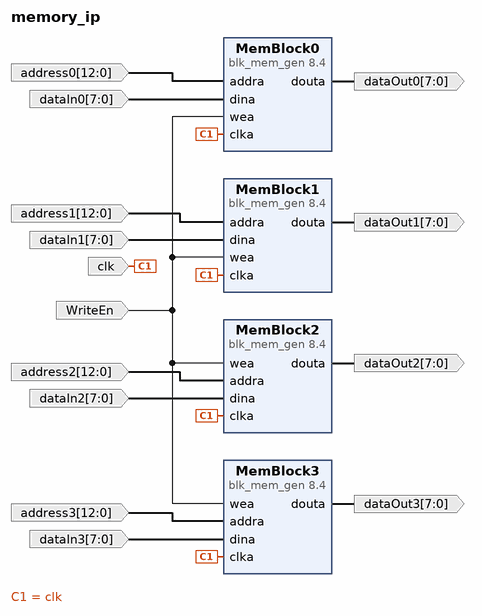
[diagram p0: block diagram of the top level]
# Vivado block design memory_ip, xc7z010clg400-1, Vivado 2023.2
create_bd_design memory_ip

create_bd_port -dir O -from 7 -to 0 dataOut0
create_bd_port -dir O -from 7 -to 0 dataOut1
create_bd_port -dir O -from 7 -to 0 dataOut2
create_bd_port -dir O -from 7 -to 0 dataOut3
create_bd_port -dir I -from 7 -to 0 -type data dataIn0
create_bd_port -dir I -from 7 -to 0 -type data dataIn1
create_bd_port -dir I -from 7 -to 0 -type data dataIn2
create_bd_port -dir I -from 7 -to 0 -type data dataIn3
create_bd_port -dir I -type clk clk
set_property -dict {CONFIG.FREQ_HZ 125000000} [get_bd_ports clk]
create_bd_port -dir I -from 12 -to 0 address1
create_bd_port -dir I -from 12 -to 0 address2
create_bd_port -dir I -from 12 -to 0 address3
create_bd_port -dir I WriteEn
create_bd_port -dir I -from 12 -to 0 address0

create_bd_cell -type ip -vlnv xilinx.com:ip:blk_mem_gen:8.4 MemBlock0
set_property -dict [list \
  CONFIG.Coe_File ../../../../../../mem0.coe \
  CONFIG.Enable_A Always_Enabled \
  CONFIG.Fill_Remaining_Memory_Locations true \
  CONFIG.Load_Init_File true \
  CONFIG.Memory_Type Single_Port_RAM \
  CONFIG.Operating_Mode_A WRITE_FIRST \
  CONFIG.Register_PortA_Output_of_Memory_Primitives false \
  CONFIG.Write_Width_A 8 \
  CONFIG.use_bram_block Stand_Alone \
] [get_bd_cells MemBlock0]
create_bd_cell -type ip -vlnv xilinx.com:ip:blk_mem_gen:8.4 MemBlock1
set_property -dict [list \
  CONFIG.Coe_File ../../../../../../mem1.coe \
  CONFIG.Enable_A Always_Enabled \
  CONFIG.Fill_Remaining_Memory_Locations true \
  CONFIG.Load_Init_File true \
  CONFIG.Memory_Type Single_Port_RAM \
  CONFIG.Operating_Mode_A WRITE_FIRST \
  CONFIG.Register_PortA_Output_of_Memory_Primitives false \
  CONFIG.Write_Width_A 8 \
  CONFIG.use_bram_block Stand_Alone \
] [get_bd_cells MemBlock1]
create_bd_cell -type ip -vlnv xilinx.com:ip:blk_mem_gen:8.4 MemBlock2
set_property -dict [list \
  CONFIG.Coe_File ../../../../../../mem2.coe \
  CONFIG.Enable_A Always_Enabled \
  CONFIG.Fill_Remaining_Memory_Locations true \
  CONFIG.Load_Init_File true \
  CONFIG.Memory_Type Single_Port_RAM \
  CONFIG.Operating_Mode_A WRITE_FIRST \
  CONFIG.Register_PortA_Output_of_Memory_Primitives false \
  CONFIG.Write_Width_A 8 \
  CONFIG.use_bram_block Stand_Alone \
] [get_bd_cells MemBlock2]
create_bd_cell -type ip -vlnv xilinx.com:ip:blk_mem_gen:8.4 MemBlock3
set_property -dict [list \
  CONFIG.Coe_File ../../../../../../mem3.coe \
  CONFIG.Enable_A Always_Enabled \
  CONFIG.Fill_Remaining_Memory_Locations true \
  CONFIG.Load_Init_File true \
  CONFIG.Memory_Type Single_Port_RAM \
  CONFIG.Operating_Mode_A WRITE_FIRST \
  CONFIG.Register_PortA_Output_of_Memory_Primitives false \
  CONFIG.Write_Width_A 8 \
  CONFIG.use_bram_block Stand_Alone \
] [get_bd_cells MemBlock3]

# ---- connections ----

connect_bd_net [get_bd_pins MemBlock0/douta] [get_bd_ports dataOut0]
connect_bd_net [get_bd_pins MemBlock1/douta] [get_bd_ports dataOut1]
connect_bd_net [get_bd_pins MemBlock2/douta] [get_bd_ports dataOut2]
connect_bd_net [get_bd_pins MemBlock3/douta] [get_bd_ports dataOut3]
connect_bd_net [get_bd_ports WriteEn] [get_bd_pins MemBlock0/wea] [get_bd_pins MemBlock1/wea] [get_bd_pins MemBlock2/wea] [get_bd_pins MemBlock3/wea]
connect_bd_net -net address0_1 [get_bd_ports address0] [get_bd_pins MemBlock0/addra]
connect_bd_net -net address1_1 [get_bd_ports address1] [get_bd_pins MemBlock1/addra]
connect_bd_net -net address2_1 [get_bd_ports address2] [get_bd_pins MemBlock2/addra]
connect_bd_net -net address3_1 [get_bd_ports address3] [get_bd_pins MemBlock3/addra]
connect_bd_net [get_bd_ports clk] [get_bd_pins MemBlock0/clka] [get_bd_pins MemBlock1/clka] [get_bd_pins MemBlock2/clka] [get_bd_pins MemBlock3/clka]
connect_bd_net -net dataIn0_1 [get_bd_ports dataIn0] [get_bd_pins MemBlock0/dina]
connect_bd_net -net dataIn1_1 [get_bd_ports dataIn1] [get_bd_pins MemBlock1/dina]
connect_bd_net -net dataIn2_1 [get_bd_ports dataIn2] [get_bd_pins MemBlock2/dina]
connect_bd_net -net dataIn3_1 [get_bd_ports dataIn3] [get_bd_pins MemBlock3/dina]

validate_bd_design
save_bd_design
